# Altium schematic sheet NRF.SchDoc
size A4
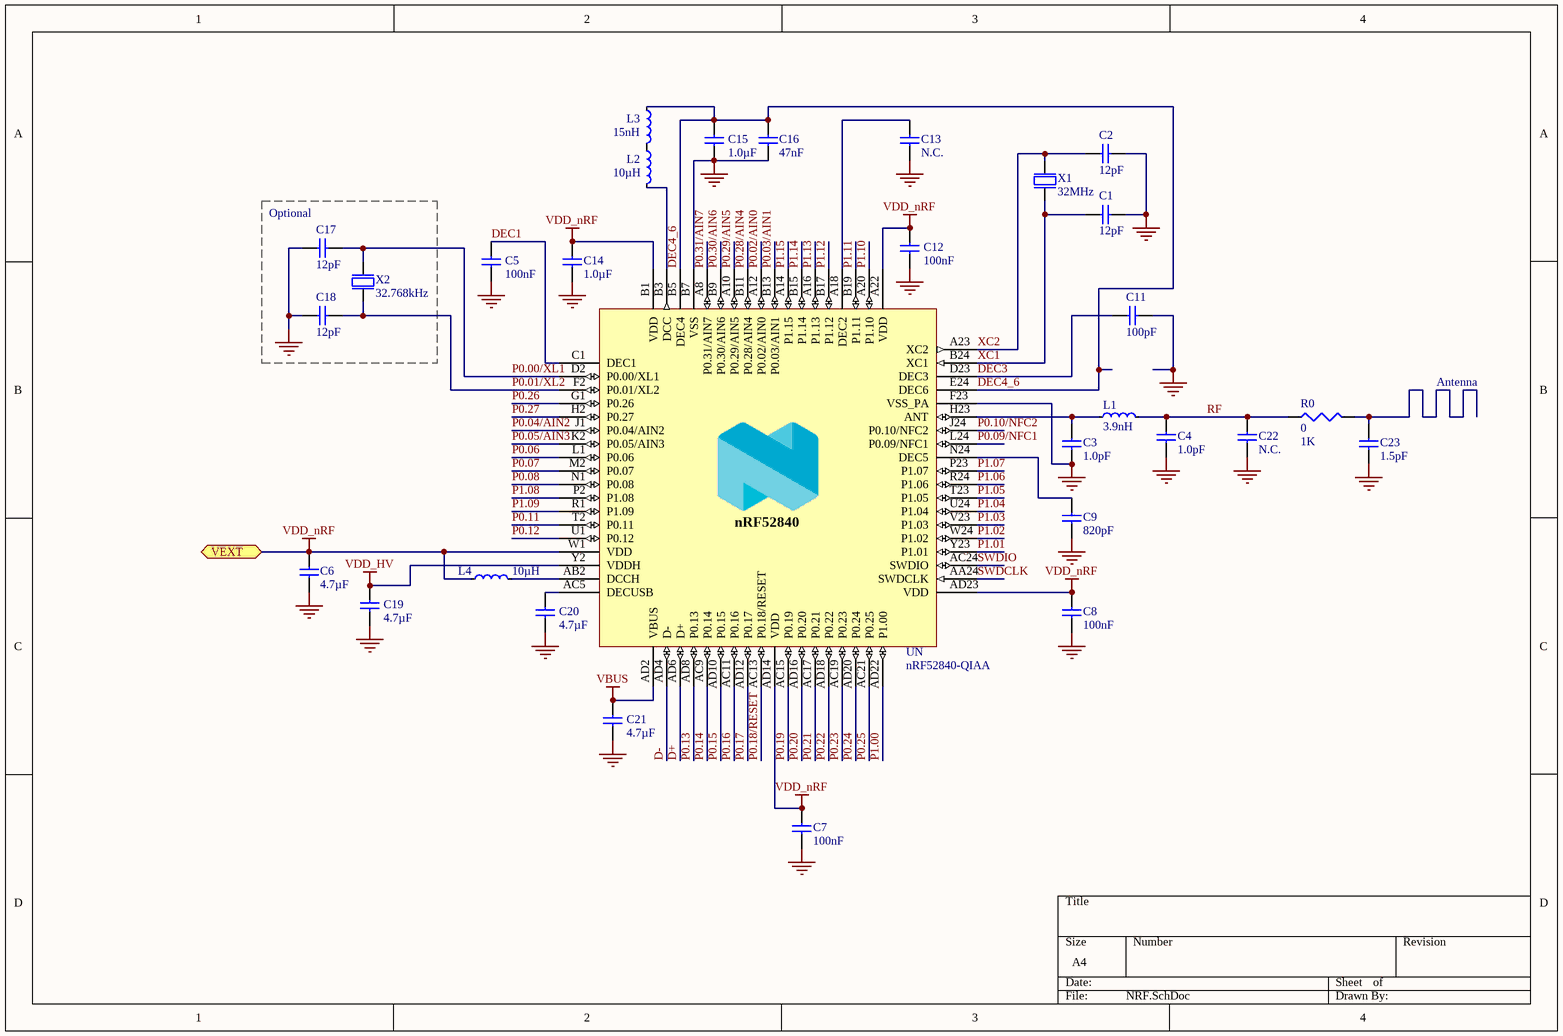
[diagram p0: NRF.SchDoc]

## Parts
C1  12pF  [CAPC1005X04L]
C2  12pF  [CAPC1005X04L]
C3  1.0pF  [CAPC1005X04L]
C4  1.0pF  [CAPC1005X04L]
C5  100nF  [CAPC1005X04L]
C6  4.7µF  [CAPC1608X06L]
C7  100nF  [CAPC1005X04L]
C8  100nF  [CAPC1005X04L]
C9  820pF  [CAPC1005X04L]
C11  100pF  [CAPC1005X04L]
C12  100nF  [CAPC1005X04L]
C13  N.C.  [CAPC1005X04L]
C14  1.0µF  [CAPC1608X06L]
C15  1.0µF  [CAPC1608X06L]
C16  47nF  [CAPC1005X04L]
C17  12pF  [CAPC1005X04L]
C18  12pF  [CAPC1005X04L]
C19  4.7µF  [CAPC1608X06L]
C20  4.7µF  [CAPC1608X06L]
C21  4.7µF  [CAPC1608X06L]
C22  N.C.  [CAPC1005X04L]
C23  1.5pF  [CAPC1005X04L]
L1  3.9nH  [INDC1005X04L]
L2  10µH  [INDC1608X06L]
L3  15nH  [INDC1005X04L]
L4  10µH  [INDC1608X06L]
R0  0  value 1K  [0402]
UN  nRF52840-QIAA  [AQFN50P700X700X85_HS-74N]
X1  32MHz  [BT-XTAL_2016]
X2  32.768kHz  [XTAL_3215]

## Blocks framed on the sheet
Optional: C17 C18 X2

## Ports
VEXT (bidir)

## Nets
GND: C1.2 C2.2 C3.1 C4.1 C5.2 C6.2 C7.2 C8.2 C9.2 C11.2 C12.2 C13.2 C14.2 C15.1 C16.2 C17.2 C18.2 C19.2 C20.2 C21.2 C22.2 C23.2 UN.74(GND) UN.B7(VSS) UN.F23(VSS_PA) X1.2(GND) X1.4(GND)
VBUS: C21.1 UN.AD2(VBUS)
VDD_HV: C19.1 UN.Y2(VDDH)
VDD_nRF: C6.1 C7.1 C8.1 C12.1 C14.1 L4.1 UN.A22(VDD) UN.AD14(VDD) UN.AD23(VDD) UN.B1(VDD) UN.W1(VDD) ; port VEXT
D+: UN.AD6(D+)
D-: UN.AD4(D-)
DEC1: C5.1 UN.C1(DEC1)
DEC3: C11.1 UN.D23(DEC3)
DEC4_6: C15.2 C16.1 L3.1 UN.B5(DEC4) UN.E24(DEC6)
P0.00/XL1: C17.1 UN.D2(P0.00/XL1) X2.1(inp)
P0.01/XL2: C18.1 UN.F2(P0.01/XL2) X2.2(out)
P0.02/AIN0: UN.A12(P0.02/AIN0)
P0.03/AIN1: UN.B13(P0.03/AIN1)
P0.04/AIN2: UN.J1(P0.04/AIN2)
P0.05/AIN3: UN.K2(P0.05/AIN3)
P0.06: UN.L1(P0.06)
P0.07: UN.M2(P0.07)
P0.08: UN.N1(P0.08)
P0.09/NFC1: UN.L24(P0.09/NFC1)
P0.10/NFC2: UN.J24(P0.10/NFC2)
P0.11: UN.T2(P0.11)
P0.12: UN.U1(P0.12)
P0.13: UN.AD8(P0.13)
P0.14: UN.AC9(P0.14)
P0.15: UN.AD10(P0.15)
P0.16: UN.AC11(P0.16)
P0.17: UN.AD12(P0.17)
P0.18/RESET: UN.AC13(P0.18/RESET)
P0.19: UN.AC15(P0.19)
P0.20: UN.AD16(P0.20)
P0.21: UN.AC17(P0.21)
P0.22: UN.AD18(P0.22)
P0.23: UN.AC19(P0.23)
P0.24: UN.AD20(P0.24)
P0.25: UN.AC21(P0.25)
P0.26: UN.G1(P0.26)
P0.27: UN.H2(P0.27)
P0.28/AIN4: UN.B11(P0.28/AIN4)
P0.29/AIN5: UN.A10(P0.29/AIN5)
P0.30/AIN6: UN.B9(P0.30/AIN6)
P0.31/AIN7: UN.A8(P0.31/AIN7)
P1.00: UN.AD22(P1.00)
P1.01: UN.Y23(P1.01)
P1.02: UN.W24(P1.02)
P1.03: UN.V23(P1.03)
P1.04: UN.U24(P1.04)
P1.05: UN.T23(P1.05)
P1.06: UN.R24(P1.06)
P1.07: UN.P23(P1.07)
P1.08: UN.P2(P1.08)
P1.09: UN.R1(P1.09)
P1.10: UN.A20(P1.10)
P1.11: UN.B19(P1.11)
P1.12: UN.B17(P1.12)
P1.13: UN.A16(P1.13)
P1.14: UN.B15(P1.14)
P1.15: UN.A14(P1.15)
RF: C4.2 C22.1 L1.2 R0.1
SWDCLK: UN.AA24(SWDCLK)
SWDIO: UN.AC24(SWDIO)
XC1: C1.1 UN.B24(XC1) X1.1(inp)
XC2: C2.1 UN.A23(XC2) X1.3(out)
NetC3_2: C3.2 L1.1 UN.H23(ANT)
NetC9_1: C9.1 UN.N24(DEC5)
NetC13_1: C13.1 UN.A18(DEC2)
NetC20_1: C20.1 UN.AC5(DECUSB)
NetC23_1: C23.1 R0.2
NetL2_1: L2.1 L3.2
NetL2_2: L2.2 UN.B3(DCC)
NetL4_2: L4.2 UN.AB2(DCCH)

## Notes on the sheet
- Antenna
- (in symbol nRF52840-QIAAC0) nRF52840

## Library data of the parts
C1 C2 C17 C18 = C0402-12p: Capacitor, NP0, ±2%; Note: 50V; Part Number: C0402-12p; LatestRevisionDate: 2011-05-11; Pin Count: 2; Publisher: Nordic Semiconductor; Published: 2009-05-08; Value: 12pF; Footprint Doc: 0402
C3 C4 = C0402-1.0p: Capacitor, NP0, ±5%; Note: 50V; Part Number: C0402-1.0p; LatestRevisionDate: 2017-02-23; Pin Count: 2; Publisher: Nordic Semiconductor; Published: 2009-05-08; Value: 1.0pF; Footprint Doc: 0402
C5 C7 C8 C12 = C0402-100n: Capacitor, X7R, ±10%; Note: 16V; Part Number: C0402-100n; LatestRevisionDate: 2009-11-23; Pin Count: 2; Publisher: Nordic Semiconductor; Published: 2009-05-08; Value: 100nF; Footprint Doc: 0402
C6 C20 = C0603-4µ7-6.3V-X7R: Capacitor, X7R, ±10%; Note: 6.3V; Part Number: C0603-4µ7-6.3V-X7R; LatestRevisionDate: 2015-06-10; Pin Count: 2; Publisher: Nordic Semiconductor; Published: 2015-06-10; Value: 4.7µF; Footprint Doc: 0603
C9 = C0402-820p: Capacitor, NP0, ±5%; Note: 50V; Part Number: C0402-820p; LatestRevisionDate: 2009-05-08; Pin Count: 2; Publisher: Nordic Semiconductor; Published: 2009-05-08; Value: 820pF; Footprint Doc: 0402
C11 = C0402-100p: Capacitor, NP0, ±5%; Note: 50V; Part Number: C0402-100p; LatestRevisionDate: 2009-05-08; Pin Count: 2; Publisher: Nordic Semiconductor; Published: 2009-05-08; Value: 100pF; Footprint Doc: 0402
C13 = C0402-N.C.: Not mounted; Assembly: Not mounted; Part Number: C0402-N.C.; LatestRevisionDate: 2009-05-08; Pin Count: 2; Publisher: Nordic Semiconductor; Published: 2009-05-08; Value: N.C.; Footprint Doc: 0402
C14 C15 = C0603-1µ0: Capacitor, X7R, ±10%; Note: 16V; Part Number: C0603-1µ0; LatestRevisionDate: 2013-06-05; Pin Count: 2; Publisher: Nordic Semiconductor; Published: 2009-05-08; Value: 1.0µF; Footprint Doc: 0603
C16 = C0402-47n: Capacitor, X7R, ±10%; Note: Chip Cap 10%; Part Number: C0402-47n; LatestRevisionDate: 2009-05-08; Pin Count: 2; Publisher: Nordic Semiconductor; Published: 2009-05-08; Value: 47nF; Footprint Doc: 0402
C19 C21 = C0603-4µ7-10V-X7S: Capacitor, X7S, ±10%; Note: 10V; Part Number: C0603-4µ7-10V-X7S; LatestRevisionDate: 2016-08-15; Pin Count: 2; Publisher: Nordic Semiconductor; Published: 2016-08-15; Value: 4.7µF; Footprint Doc: 0603
C22 = C0402-N.C.: Not mounted; Note: Chip Cap; Assembly: Not mounted; Part Number: C0402-N.C.; LatestRevisionDate: 2009-05-08; Pin Count: 2; Publisher: Nordic Semiconductor; Published: 2009-05-08; Value: N.C.; Footprint Doc: 0402
C23 = C0402-N.C.: Not mounted; Value: N.C.; Note: Chip Cap; Assembly: Not mounted; Part Number: C0402-N.C.; LatestRevisionDate: 2009-05-08; Pin Count: 2; Publisher: Nordic Semiconductor; Published: 2009-05-08; Footprint Doc: 0402
L1 = L0402-3n9: High frequency chip inductor ±5%; Part Number: L0402-3n9; LatestRevisionDate: 2012-09-19; Pin Count: 2; Publisher: Nordic Semiconductor; Published: 2009-05-08; Value: 3.9nH; Footprint Doc: 0402
L2 = L0603-10µ: Chip inductor, IDC,min = 50 mA, ±20%; Part Number: L0603-10µ; LatestRevisionDate: 2012-09-19; Pin Count: 2; Publisher: Nordic Semiconductor; Published: 2010-02-24; Value: 10µH; Footprint Doc: 0603
L3 = L0402-15n: High frequency chip inductor ±10%; Part Number: L0402-15n; LatestRevisionDate: 2012-09-19; Pin Count: 2; Publisher: Nordic Semiconductor; Published: 2010-07-12; Value: 15nH; Footprint Doc: 0402
L4 = L0603-10µ: Chip inductor, IDC,min = 80 mA, ±20%; Part Number: L0603-10µ; LatestRevisionDate: 2012-09-19; Pin Count: 2; Publisher: Nordic Semiconductor; Published: 2010-02-24; Value: 10µH; Footprint Doc: 0603
R0 = Res3: Resistor; Published: 8-Jun-2000; LatestRevisionDate: 29-May-2009; LatestRevisionNote: IPC-7351 Footprint Added.; PackageReference: J1-0603; Publisher: Altium Limited; PackageDescription: Chip Resistor
UN = nRF52840-QIAAC0: Multi-protocol Bluetooth Low Energy, IEEE 802.15.4, ANT and 2.4GHz proprietary system-on-chip; Manufacturer: Nordic Semiconductor; Part Number: nRF52840-QIAAC0; LatestRevisionDate: 2018-02-27; Pin Count: 73; Publisher: Nordic Semiconductor; Published: 2017-08-21; Value: nRF52840-QIAA; Note: *; Footprint Doc: AQFN-73; Manufacturer Part Number: nRF52840-QIAAC0
X1 = XTAL_SMD2016_32MHz_8pF_General: XTAL SMD 2016, 32MHz, Cl=8pF, Total Tol: ±40ppm; Part Number: XTAL_SMD2016_32MHz_8pF_General; LatestRevisionDate: 2016-08-19; Pin Count: 4; Publisher: Nordic Semiconductor; Published: 2016-08-19; Value: 32MHz; Footprint Doc: XTAL_2016
X2 = XTAL_SMD3215_32.768kHz_9pF_General: XTAL SMD 3215, 32.768kHz, Cl=9pF, Total Tol: ±50ppm; Part Number: XTAL_SMD3215_32.768kHz_9pF_General; LatestRevisionDate: 2016-08-19; Pin Count: 2; Publisher: Nordic Semiconductor; Published: 2016-08-19; Value: 32.768kHz; Footprint Doc: XTAL_3215